# Altium schematic sheet ESP32-C3-MINI-1U-H4.SchDoc
size A; SheetNumber: 4; SheetTotal: 8
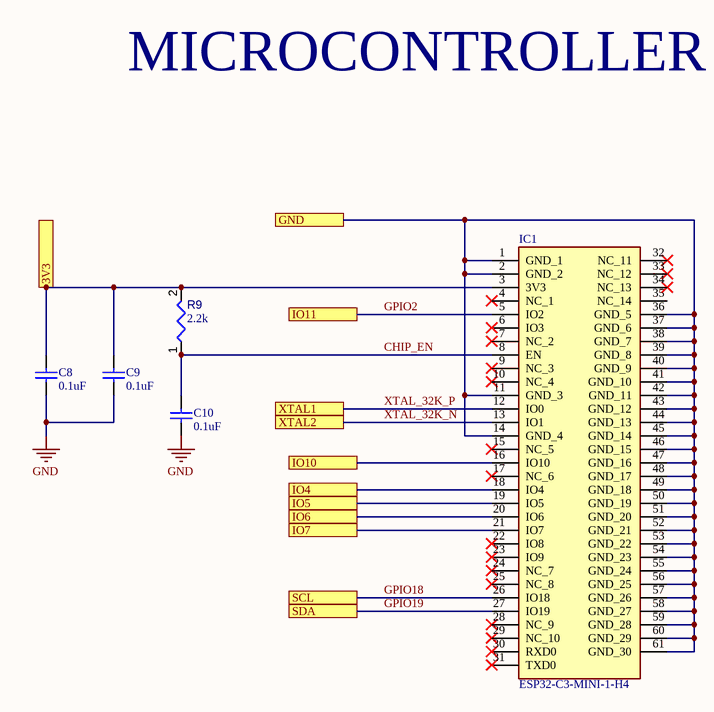
[diagram p0: ESP32-C3-MINI-1U-H4.SchDoc]

## Parts
C8  0.1uF  [CAPC1608X90X35ML10T15]
C9  0.1uF  [CAPC1608X90X35ML10T15]
C10  0.1uF  [CAPC1608X90X35ML10T15]
IC1  ESP32-C3-MINI-1-H4  [ESP32C3MINI1H4]
R9  value 2.2k  [RESC0402(1005)_L]  (hidden comment: Resistor 2K2  +/-5 % 0402 63 mW)

## Ports
3V3 (see mainsheet[3C], powercircuit[1B]), GND (see mainsheet[3C], powercircuit[1C]), IO4 (see mainsheet[2C]), IO5 (see mainsheet[2C]), IO6 (see mainsheet[2C]), IO7 (see mainsheet[2C]), IO10 (see mainsheet[2C]), IO11 (see mainsheet[3B]), SCL (see mainsheet[3B], MAXREFDES117[1B], temp[2B]), SDA (see mainsheet[3B], MAXREFDES117[1B], temp[2B]), XTAL1 (see mainsheet[2B]), XTAL2 (see mainsheet[2B])

## Nets
GND: C8.2 C9.2 C10.2
3V3: C8.1 C9.1 IC1.3(3V3) R9.2 ; port 3V3
CHIP_EN: C10.1 IC1.8(EN) R9.1
GND: IC1.1(GND_1) IC1.2(GND_2) IC1.11(GND_3) IC1.14(GND_4) IC1.36(GND_5) IC1.37(GND_6) IC1.38(GND_7) IC1.39(GND_8) IC1.40(GND_9) IC1.41(GND_10) IC1.42(GND_11) IC1.43(GND_12) IC1.44(GND_13) IC1.45(GND_14) IC1.46(GND_15) IC1.47(GND_16) IC1.48(GND_17) IC1.49(GND_18) IC1.50(GND_19) IC1.51(GND_20) IC1.52(GND_21) IC1.53(GND_22) IC1.54(GND_23) IC1.55(GND_24) IC1.56(GND_25) IC1.57(GND_26) IC1.58(GND_27) IC1.59(GND_28) IC1.60(GND_29) IC1.61(GND_30) ; port GND  [a separate net that carries the same name]
GPIO2: IC1.5(IO2) ; port IO11
GPIO18: IC1.26(IO18) ; port SCL
GPIO19: IC1.27(IO19) ; port SDA
IO4: IC1.18(IO4) ; port IO4
IO5: IC1.19(IO5) ; port IO5
IO6: IC1.20(IO6) ; port IO6
IO7: IC1.21(IO7) ; port IO7
IO10: IC1.16(IO10) ; port IO10
XTAL_32K_N: IC1.13(IO1) ; port XTAL2
XTAL_32K_P: IC1.12(IO0) ; port XTAL1

Not connected (* = marked no-connect by the designer): IC1 4(NC_1)* 6(IO3)* 7(NC_2)* 9(NC_3)* 10(NC_4)* 15(NC_5)* 17(NC_6)* 22(IO8)* 23(IO9)* 24(NC_7)* 25(NC_8)* 28(NC_9)* 29(NC_10)* 30(RXD0)* 31(TXD0)* 32(NC_11)* 33(NC_12)* 34(NC_13)* 35(NC_14)

## Notes on the sheet
- MICROCONTROLLER

## Library data of the parts
C8-C10 = CMP-2100-03643-1: Chip Capacitor, 0.1 uF, +/- 10%, 50 V, -55 to 125 degC, 0603 (1608 Metric), RoHS, Tape and Reel; Manufacturer: Murata; Dielectric Material: Ceramic; Voltage Rating: 50V; Capacitance: 100nF; Dielectric: X7R; Insulation Resistance: 10GR; Case Code (Metric): 1608; Lead Free: LeadFree; Depth: 0.8mm; Number of Pins: 2; Radiation Hardening: No; Case/Package: 0603; Manufacturer URL: http://www.murata.com/; Packaging: TapeandReel; Length: 1.6mm; Contact Plating: Tin; Datasheet URL: http://psearch.en.murata.com/capacitor/product/GRM188R71H104KA93%23.pdf; Tolerance: 10%; Case Code (Imperial): 0603; Min Operating Temperature: -55degC; RoHSCompliant: true; Voltage: 50V; Termination: SMD/SMT; Mount: SurfaceMount; Material: Ceramic; Package Quantity: 1; Height: 0.8mm; Thickness: 0.035inch; REACH SVHC: NoSVHC; Max Operating Temperature: 125degC; Width: 0.8mm; Package Reference: 0603; Voltage Rating (DC): 50V; Datasheet Version: 42675.0; Package Description: 2-Pin Surface Mount Device, Body 1.6 x 0.8 mm
IC1 = ESP32-C3-MINI-1-H4: Integrated Circuit; Manufacturer_Name: Espressif Systems; Datasheet Link: https://www.mouser.es/datasheet/2/891/Espressif_ESP32_C3_MINI_1_Datasheet-2006822.pdf; Height: 2.55mm; Manufacturer_Part_Number: ESP32-C3-MINI-1-H4; Mouser Part Number: 356-ESP32-C3-MINI1H4; Mouser Price/Stock: https://www.mouser.co.uk/ProductDetail/Espressif-Systems/ESP32-C3-MINI-1-H4?qs=stqOd1AaK78JkwNX13Q9hQ%3D%3D
R9 = CMP-009-00166-3: Chip Resistor, 2,2 kOhms, +/-5 %, 63 mW, -55 to 155 degC, 0402; Power: 63mW; Tolerance: 5%; Pins: 2; Min Operating Temperature: -55°C; Max Operating Temperature: 155°C; Case/Package: 0402